# Altium project DaughterBoard.PrjPcb
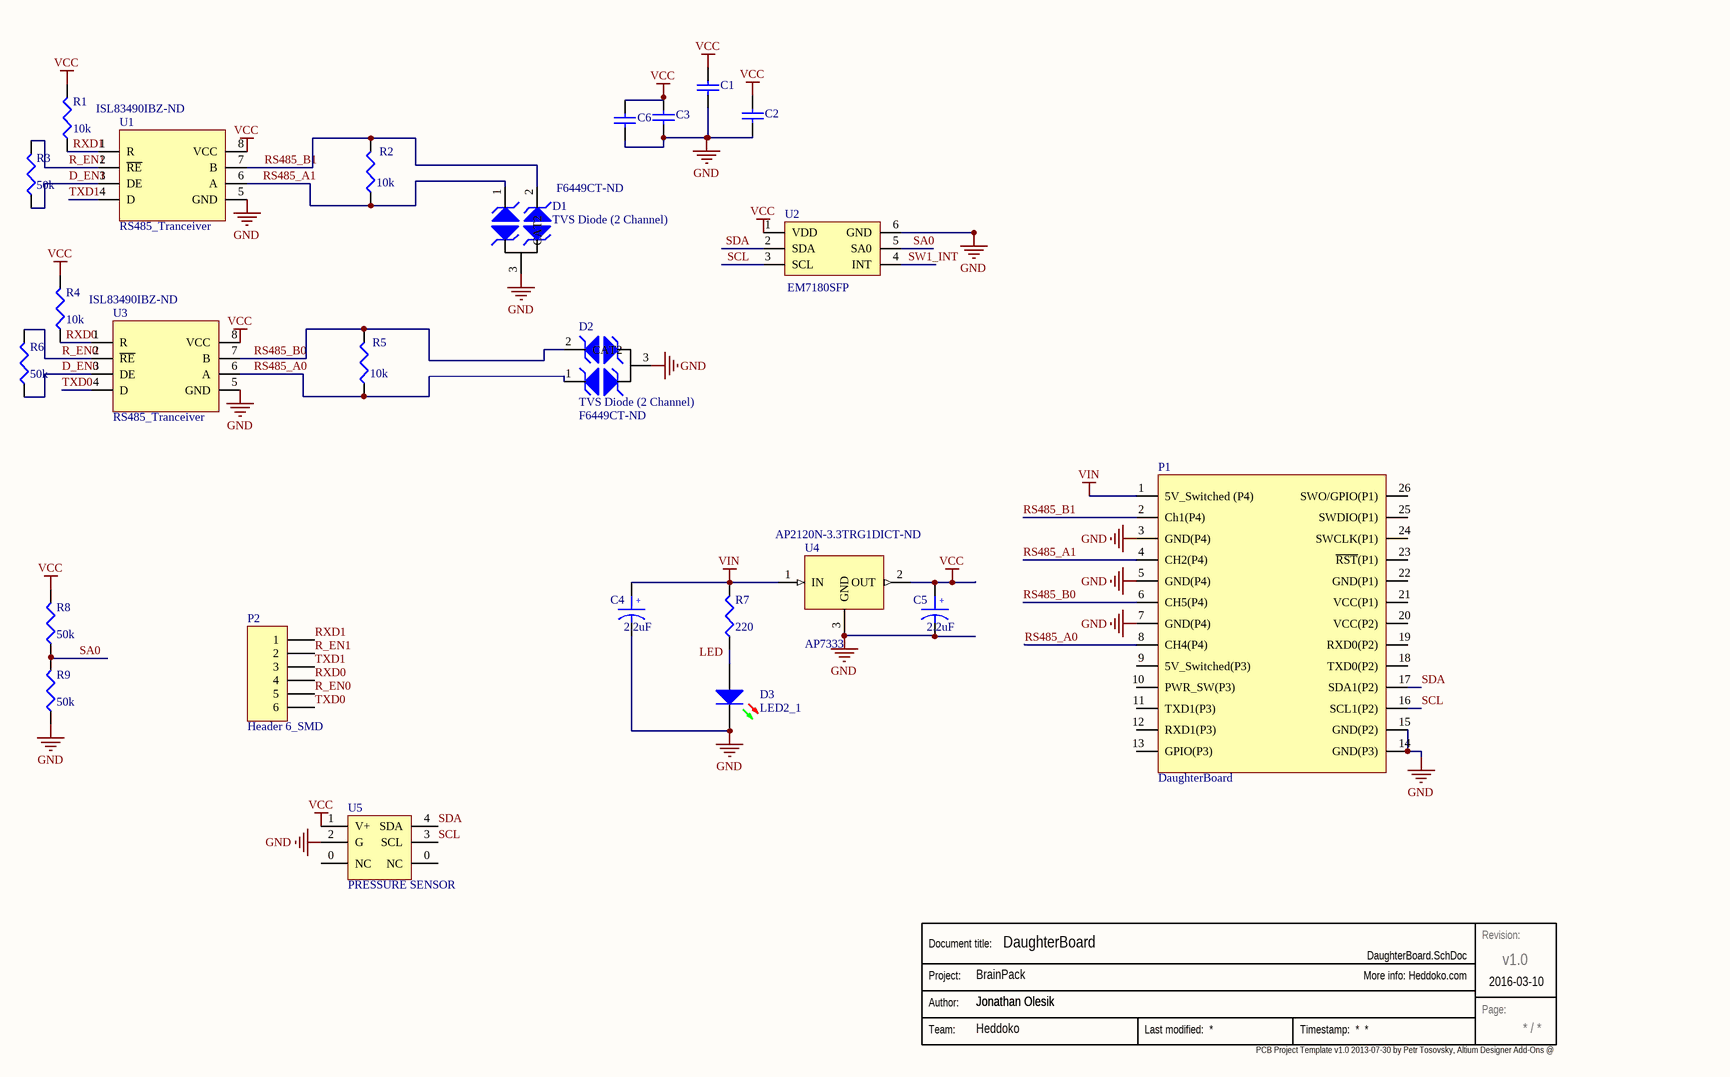
[diagram p0: DaughterBoard.SchDoc]
GlobalProjectLink: Heddoko.com; GlobalProjectName: BrainPack; GlobalProjectRevision: v1.0; GlobalProjectTeam: Heddoko; GlobalRevisionDate: 2016-03-10
1 sheet, 26 parts. Net scope: global (net labels, ports and power ports of the same name join across sheets).
Board file: DaughterBoard.PcbDoc

## Sheet DaughterBoard.SchDoc: DaughterBoard
size A4; Author: Jonathan Olesik

### Parts
C1  Cap  [0603]  (value not drawn)
C2  Cap  [0603]  (value not drawn)
C3  Cap  [0603]  (value not drawn)
C4  value 2.2uF  [SMD0805]
C5  value 2.2uF  [SMD0805]
C6  Cap  [0603]  (value not drawn)
D1  TVS Diode (2 Channel)  Supplier Part Number: F6449CT-ND  [SOT23-3]
D2  TVS Diode (2 Channel)  Supplier Part Number: F6449CT-ND  [SOT23-3]
D3  LED2_1  [LED0603]
P1  DaughterBoard  [PowerBoardDaughter]
P2  Header 6_SMD  [Header 6 1.27mm]
R1  value 10k  [0603]
R2  value 10k  [0402]
R3  value 50k  [0402]
R4  value 10k  [0603]
R5  value 10k  [0402]
R6  value 50k  [0402]
R7  value 220  [0603]
R8  value 50k  [0402]
R9  value 50k  [0402]
Stamp  Stamp  (value not drawn)  (graphical)
U1  RS485_Tranceiver  Supplier Part Number: ISL83490IBZ-ND  [SOIC8]
U2  EM7180SFP  [EM7180SFP]
U3  RS485_Tranceiver  Supplier Part Number: ISL83490IBZ-ND  [SOIC8]
U4  AP7333  Supplier Part Number: AP2120N-3.3TRG1DICT-ND  [SOT23-3]
U5  PRESSURE SENSOR  [NPA-201]

### Nets
GND: C1.1 C2.1 C3.1 C4.2 C5.2 C6.1 D1.3(Double_Cat) D2.3(Double_Cat) D3.2(K) P1.3(GND(P4)) P1.5(GND(P4)) P1.7(GND(P4)) P1.14(GND(P3)) P1.15(GND(P2)) R9.1 U1.5(GND) U2.6(GND) U3.5(GND) U4.3(GND) U5.2(G)
VCC: C1.2 C2.2 C3.2 C5.1 C6.2 R1.2 R4.2 R8.2 U1.8(VCC) U2.1(VDD) U3.8(VCC) U4.2(OUT) U5.1(V+)
VIN: C4.1 P1.1(5V_Switched_(P4)) R7.2 U4.1(IN)
D_EN0: R6.1 U3.3(DE)
D_EN1: R3.1 U1.3(DE)
R_EN0: P2.5 R6.2 U3.2(~{RE})
R_EN1: P2.2 R3.2 U1.2(~{RE})
RS485_A0: D2.1(CAT1) P1.8(CH4(P4)) R5.1 U3.6(A)
RS485_A1: D1.1(CAT1) P1.4(CH2(P4)) R2.1 U1.6(A)
RS485_B0: D2.2(CAT2) P1.6(CH5(P4)) R5.2 U3.7(B)
RS485_B1: D1.2(CAT2) P1.2(Ch1(P4)) R2.2 U1.7(B)
RXD0: P2.4 R4.1 U3.1(R)
RXD1: P2.1 R1.1 U1.1(R)
SA0: R8.1 R9.2 U2.5(SA0)
SCL: P1.16(SCL1(P2)) U2.3(SCL) U5.3(SCL)
SDA: P1.17(SDA1(P2)) U2.2(SDA) U5.4(SDA)
SW1_INT: U2.4(INT)
TXD0: P2.6 U3.4(D)
TXD1: P2.3 U1.4(D)
NetD3_1: D3.1(A) R7.1

Not connected (* = marked no-connect by the designer): P1 9(5V_Switched(P3)) 10(PWR_SW(P3)) 11(TXD1(P3)) 12(RXD1(P3)) 13(GPIO(P3)) 18(TXD0(P2)) 19(RXD0(P2)) 20(VCC(P2)) 21(VCC(P1)) 22(GND(P1)) 23(~{RST}(P1)) 24(SWCLK(P1)) 25(SWDIO(P1)) 26(SWO/GPIO(P1)); U5 0(NC)

### Notes on the sheet
- PCB Project Template v1.0 2013-07-30 by Petr Tosovsky, Altium Designer Add-Ons @ <http://www.edatools.cz/addons>
- Labels drawn without touching a wire or pin: LED
- (in symbol A01-0492) +
- (in symbol Stamp) Revision:; Document title:; Project:; Author:; Page:; Team:

### Library data of the parts
C1-C3 C6 = Cap: Capacitor; Published: 8-Jun-2000; LatestRevisionDate: 17-Jul-2002; LatestRevisionNote: Re-released for DXP Platform.; PackageReference: RAD-0.3; Publisher: Altium Limited
C4 C5 = A01-0492: Manufacturer Size Code: P; Manufacturer: AVX Corporation; Manufacturer Part Number: F921A225MPA; Tolerance: ±20%; Type: Molded; ESR (Equivalent Series Resistance): 12 Ohm; Capacitance: 2.2µF; Voltage - Rated: 10V; Category: Capacitors; Size / Dimension: 0.079" L x 0.049" W (2.00mm x 1.25mm); RoHS: RoHS Compliant; Operating Temperature: -55°C ~ 125°C; Mounting Type: Surface Mount; Package / Case: 0805 (2012 Metric); Height - Seated (Max): 0.039" (1.00mm); Lifetime @ Temp.: -; Supplier: Digi-Key; Packaging: Cut Tape (CT); Features: General Purpose; Lead Spacing: -; Supplier Part Number: 478-8123-1-ND; ComponentLink1URL: http://www.avx.com/docs/Catalogs/f92.pdf; ComponentLink1Description: http://www.avx.com/docs/Catalogs/f92.pdf; Pricing: 1=0.45, 10=0.397, 100=0.1983, 250=0.15856, 500=0.14442, 1000=0.13025 (CAD)
D1 D2 = TVS Diode (2 Channel): Manufacturer Part Number: SM24CANA-02HTG; Manufacturer: Littelfuse Inc.; Bidirectional Channels: 2; Type: Zener; Current - Peak Pulse (10/1000µs): 3A (8/20µs); Voltage - Breakdown (Min): 26.7V; Capacitance @ Frequency: 11pF @ 1MHz; Power Line Protection: No; Voltage - Clamping (Max) @ Ipp: 50V; Power - Peak Pulse: 200W; Voltage - Reverse Standoff (Typ): 24V (Max); Operating Temperature: -40°C ~ 125°C (TJ); Supplier Device Package: SOT-23-3; Mounting Type: Surface Mount; Applications: Automotive, CAN; Packaging: Cut Tape (CT); Unidirectional Channels: -; Package / Case: TO-236-3, SC-59, SOT-23-3; RoHS: RoHS Compliant; Supplier: Digi-Key; Category: Circuit Protection; ComponentLink1URL: http://www.littelfuse.com/~/media/Electronics/Datasheets/TVS_Diode_Arrays/Littelfuse_TVS_Diode_Array_SM24CANA_Datasheet.pdf.pdf; ComponentLink1Description: http://www.littelfuse.com/~/media/Electronics/Datasheets/TVS_Diode_Arrays/Littelfuse_TVS_Diode_Array_SM24CANA_Datasheet.pdf.pdf; Pricing: 1=0.79, 10=0.613, 25=0.5176, 100=0.4218, 250=0.3494, 500=0.28862, 1000=0.21618 (CAD)
D3 = LED2_1: Typical RED, GREEN, YELLOW, AMBER GaAs LED; Published: 8-Jun-2000; LatestRevisionDate: 17-Jul-2002; LatestRevisionNote: Re-released for DXP Platform.; PackageVersion: Feb-2002; PackageReference: 3.2X1.6X1.1; Publisher: Altium Limited; PackageDescription: SM LED; 2 Flat Leads
P2 = Header 6_SMD: Header, 6-Pin SMD; LatestRevisionDate: 17-Jul-2002; LatestRevisionNote: Re-released for DXP Platform.; Publisher: Altium Limited
R1-R9 = Res3: Resistor; Published: 8-Jun-2000; LatestRevisionDate: 04-Mar-2005; LatestRevisionNote: PCB Footprint replaced.; PackageReference: J1-0603; Publisher: Altium Limited
U1 U3 = RS485_Tranceiver: Manufacturer Part Number: ISL83490IBZ; Manufacturer: Intersil; Number of Drivers/Receivers: 1/1; Voltage - Supply: 3 V ~ 3.6 V; Duplex: Full; Data Rate: 10Mbps; Protocol: RS422, RS485; Receiver Hysteresis: 50mV; Supplier: Digi-Key; Operating Temperature: -40°C ~ 85°C; Category: Integrated Circuits (ICs); Mounting Type: Surface Mount; Type: Transceiver; RoHS: RoHS Compliant; Package / Case: 8-SOIC (0.154", 3.90mm Width); Packaging: Tube; Supplier Device Package: 8-SOIC; Pricing: 1=1.97, 10=1.767, 100=1.3774, 500=1.13784, 1000=0.8983 (CAD); ComponentLink1URL: http://www.intersil.com/content/dam/Intersil/documents/isl8/isl83483-85-88-90-91.pdf; ComponentLink1Description: http://www.intersil.com/content/dam/Intersil/documents/isl8/isl83483-85-88-90-91.pdf
U4 = AP7333: 3.3 V regulator; Manufacturer: Diodes Incorporated; Manufacturer Part Number: AP2120N-3.3TRG1; Number of Regulators: 1; Voltage - Output: 3.3V; Regulator Topology: Positive Fixed; Current - Output: 150mA; Voltage - Input: Up to 6V; Voltage - Dropout (Typical): 0.3V @ 150mA; Supplier Device Package: SOT-23; Packaging: Cut Tape (CT); Supplier: Digi-Key; Category: Integrated Circuits (ICs); RoHS: RoHS Compliant; Current - Limit (Min): -; Package / Case: TO-236-3, SC-59, SOT-23-3; Operating Temperature: -40°C ~ 85°C; Mounting Type: Surface Mount; ComponentLink1URL: http://www.diodes.com/_files/datasheets/AP2120.pdf; ComponentLink1Description: http://www.diodes.com/_files/datasheets/AP2120.pdf; Pricing: 1=0.54, 10=0.399, 100=0.2252, 500=0.1494, 1000=0.11459 (CAD)
U5 = NPA-201: NPA-201-EV